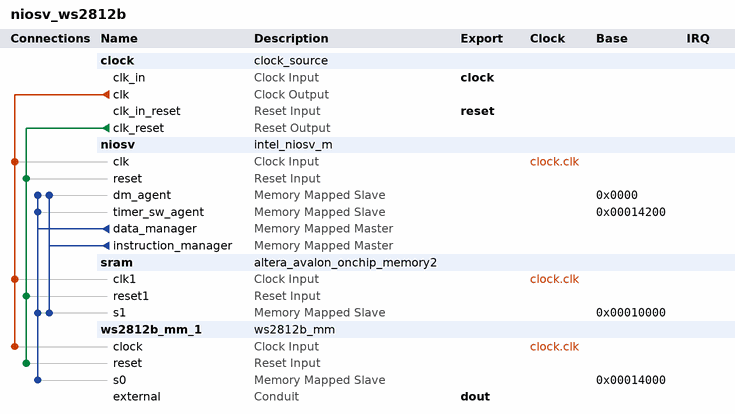
[diagram p0: system contents]
# Platform Designer (Qsys) system niosv_ws2812b, Cyclone 10 LP 10CL006YE144A7G
# Parameters at their usual value, and those the tool derives, are not listed.
package require -exact qsys 25.1
create_system niosv_ws2812b
set_project_property DEVICE_FAMILY {Cyclone 10 LP}
set_project_property DEVICE 10CL006YE144A7G

add_instance clock clock_source 25.1
set_instance_parameter_value clock clockFrequency 50000000

add_instance niosv intel_niosv_m 26.0.0
set_instance_parameter_value niosv enableAvalonInterface false
set_instance_parameter_value niosv enableDebugReset false
set_instance_parameter_value niosv enableECCFull false
set_instance_parameter_value niosv enableECCLite false
set_instance_parameter_value niosv hartId 0
set_instance_parameter_value niosv interruptMode 0
set_instance_parameter_value niosv pipelineArch true
set_instance_parameter_value niosv resetSlave sram.s1

add_instance sram altera_avalon_onchip_memory2 25.1
set_instance_parameter_value sram dataWidth 32
set_instance_parameter_value sram dualPort false
set_instance_parameter_value sram initMemContent true
set_instance_parameter_value sram initializationFileName onchip_mem.hex
set_instance_parameter_value sram memorySize 16384

add_instance ws2812b_mm_1 ws2812b_mm 1.0
set_instance_parameter_value ws2812b_mm_1 LED_NUMBER 64

# connections
add_connection clock.clk niosv.clk clock
add_connection clock.clk sram.clk1 clock
add_connection clock.clk ws2812b_mm_1.clock clock
add_connection clock.clk_reset niosv.reset reset
add_connection clock.clk_reset sram.reset1 reset
add_connection clock.clk_reset ws2812b_mm_1.reset reset
add_connection niosv.data_manager niosv.dm_agent avalon
set_connection_parameter_value niosv.data_manager/niosv.dm_agent baseAddress 0x0000
add_connection niosv.data_manager niosv.timer_sw_agent avalon
set_connection_parameter_value niosv.data_manager/niosv.timer_sw_agent baseAddress 0x00014200
add_connection niosv.data_manager sram.s1 avalon
set_connection_parameter_value niosv.data_manager/sram.s1 baseAddress 0x00010000
add_connection niosv.data_manager ws2812b_mm_1.s0 avalon
set_connection_parameter_value niosv.data_manager/ws2812b_mm_1.s0 baseAddress 0x00014000
add_connection niosv.instruction_manager niosv.dm_agent avalon
set_connection_parameter_value niosv.instruction_manager/niosv.dm_agent baseAddress 0x0000
add_connection niosv.instruction_manager sram.s1 avalon
set_connection_parameter_value niosv.instruction_manager/sram.s1 baseAddress 0x00010000

# exported interfaces
add_interface clock clock sink
set_interface_property clock EXPORT_OF clock.clk_in
add_interface dout conduit end
set_interface_property dout EXPORT_OF ws2812b_mm_1.external
add_interface reset reset sink
set_interface_property reset EXPORT_OF clock.clk_in_reset

set_interconnect_requirement {$system} qsys_mm.clockCrossingAdapter HANDSHAKE
set_interconnect_requirement {$system} qsys_mm.enableEccProtection FALSE
set_interconnect_requirement {$system} qsys_mm.insertDefaultSlave FALSE
set_interconnect_requirement {$system} qsys_mm.maxAdditionalLatency 1

save_system niosv_ws2812b.qsys
